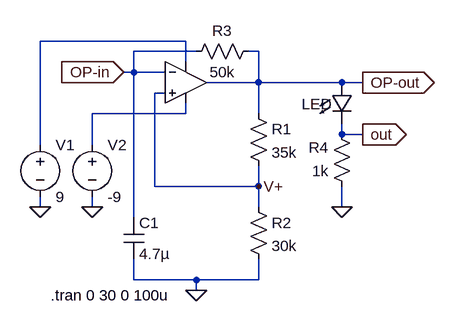
[diagram p0: schematic Init_Model_Op_ALL_Var.asc]
Init_Model_Op_ALL_Var.asc, the LTspice schematic file:
Version 4
SHEET 1 880 680
WIRE 224 128 0 128
WIRE 240 144 144 144
WIRE 336 144 320 144
WIRE 224 160 224 128
WIRE 144 176 144 144
WIRE 144 176 128 176
WIRE 192 176 144 176
WIRE 336 192 336 144
WIRE 336 192 256 192
WIRE 464 192 336 192
WIRE 496 192 464 192
WIRE 192 208 176 208
WIRE 224 240 224 224
WIRE 224 240 80 240
WIRE 336 240 336 192
WIRE 464 272 464 256
WIRE 496 272 464 272
WIRE 0 288 0 128
WIRE 80 288 80 240
WIRE 176 352 176 208
WIRE 336 352 336 320
WIRE 336 352 176 352
WIRE 0 384 0 368
WIRE 80 384 80 368
WIRE 336 384 336 352
WIRE 464 384 464 352
WIRE 144 400 144 176
WIRE 144 496 144 464
WIRE 240 496 144 496
WIRE 336 496 336 464
WIRE 336 496 240 496
WIRE 240 512 240 496
FLAG 240 512 0
FLAG 0 384 0
FLAG 80 384 0
FLAG 464 384 0
FLAG 496 272 out
IOPIN 496 272 Out
FLAG 496 192 OP-out
IOPIN 496 192 Out
FLAG 128 176 OP-in
IOPIN 128 176 In
FLAG 336 352 V+
SYMBOL OpAmps\\LM741 224 128 R0
WINDOW 0 16 32 Invisible 2
WINDOW 3 16 96 Invisible 2
SYMATTR InstName U1
SYMBOL res 320 224 R0
SYMATTR InstName R1
SYMATTR Value 35k
SYMBOL res 320 368 R0
SYMATTR InstName R2
SYMATTR Value 30k
SYMBOL res 336 128 R90
WINDOW 0 0 56 VBottom 2
WINDOW 3 32 56 VTop 2
SYMATTR InstName R3
SYMATTR Value 50k
SYMBOL cap 128 400 R0
SYMATTR InstName C1
SYMATTR Value 4.7µ
SYMBOL voltage 0 272 R0
SYMATTR InstName V1
SYMATTR Value 9
SYMBOL voltage 80 272 R0
SYMATTR InstName V2
SYMATTR Value -9
SYMBOL LED 448 192 R0
WINDOW 0 -46 33 Left 2
WINDOW 3 24 64 Invisible 2
SYMATTR InstName LED
SYMATTR Value AOT-2015
SYMATTR Description Diode
SYMATTR Type diode
SYMBOL res 480 368 R180
WINDOW 0 36 76 Left 2
WINDOW 3 36 40 Left 2
SYMATTR InstName R4
SYMATTR Value 1k
TEXT 16 520 Left 2 !.tran 0 30 0 100u

The netlist it stands for:
* Init_Model_Op_ALL_Var.asc
XU1 V+ OP-in N001 N002 OP-out LM741  ; pins In+ In- V+ V- OUT
R1 OP-out V+ 35k
R2 V+ 0 30k
R3 OP-out OP-in 50k
C1 OP-in 0 4.7µ
V1 N001 0 9
V2 N002 0 -9
D§LED OP-out out AOT-2015
R4 0 out 1k
.model D D
.lib standard.dio
.tran 0 30 0 100u
.lib LM741.lib
.backanno
.end